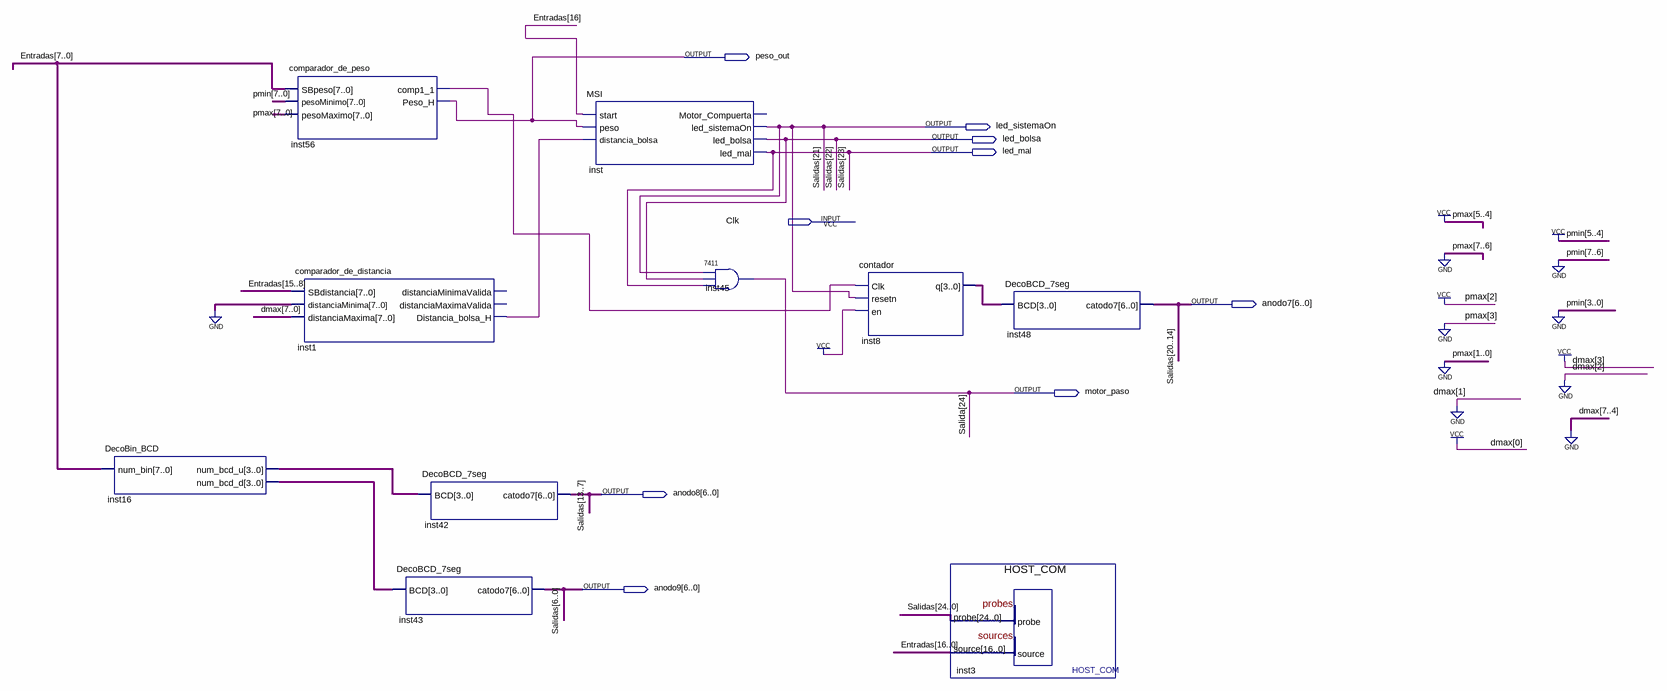
[diagram p0: schematic sheet]
// Quartus schematic envasadoGeneral.bdf as structural Verilog: 10 symbols, 9 pins
module envasadoGeneral (
  input  Clk,
  output peso_out,
  output led_sistemaOn,
  output led_bolsa,
  output led_mal,
  output [6:0] anodo7,
  output motor_paso,
  output [6:0] anodo8,
  output [6:0] anodo9
);

  wire inst1_distancia_bolsa_h, inst56_comp1_1;
  wire [3:0] inst8_q, inst16_num_bcd_d, inst16_num_bcd_u;
  wire [16:0] Entradas;
  wire [24:24] Salidas;

  DecoBin_BCD inst16 (.num_bin(Entradas[7:0]), .num_bcd_u(inst16_num_bcd_u), .num_bcd_d(inst16_num_bcd_d));
  comparador_de_peso inst56 (
    .SBpeso(Entradas[7:0]), .pesoMinimo(8'b00110000), .pesoMaximo(8'b00110100), .comp1_1(inst56_comp1_1),
    .Peso_H(peso_out));
  comparador_de_distancia inst1 (
    .SBdistancia(Entradas[15:8]), .distanciaMinima({8{1'b0}}), .distanciaMaxima(8'b00001001),
    .Distancia_bolsa_H(inst1_distancia_bolsa_h));  // open: distanciaMinimaValida, distanciaMaximaValida
  DecoBCD_7seg inst42 (.BCD(inst16_num_bcd_u), .catodo7(anodo8));
  DecoBCD_7seg inst43 (.BCD(inst16_num_bcd_d), .catodo7(anodo9));
  MSI inst (
    .start(Entradas[16]), .peso(peso_out), .distancia_bolsa(inst1_distancia_bolsa_h),
    .led_sistemaOn(led_sistemaOn), .led_bolsa(led_bolsa), .led_mal(led_mal));  // open: Motor_Compuerta
  \7411  inst45 (.\2 (led_sistemaOn), .\3 (led_bolsa), .\4 (led_mal), .\1 (motor_paso));
  contador inst8 (.Clk(inst56_comp1_1), .resetn(led_sistemaOn), .en(1'b1), .q(inst8_q));
  HOST_COM inst3 (.probe({Salidas[24], led_mal, led_bolsa, led_sistemaOn, anodo7, anodo8, anodo9}), .source(Entradas));
  DecoBCD_7seg inst48 (.BCD(inst8_q), .catodo7(anodo7));

  // Other names for the same wires on the sheet: Salidas[23:0] = {led_mal, led_bolsa, led_sistemaOn, anodo7, anodo8, anodo9};
  //   Salida[24] = motor_paso
endmodule
